# Altium schematic sheet PowerSupply.SchDoc
size A4
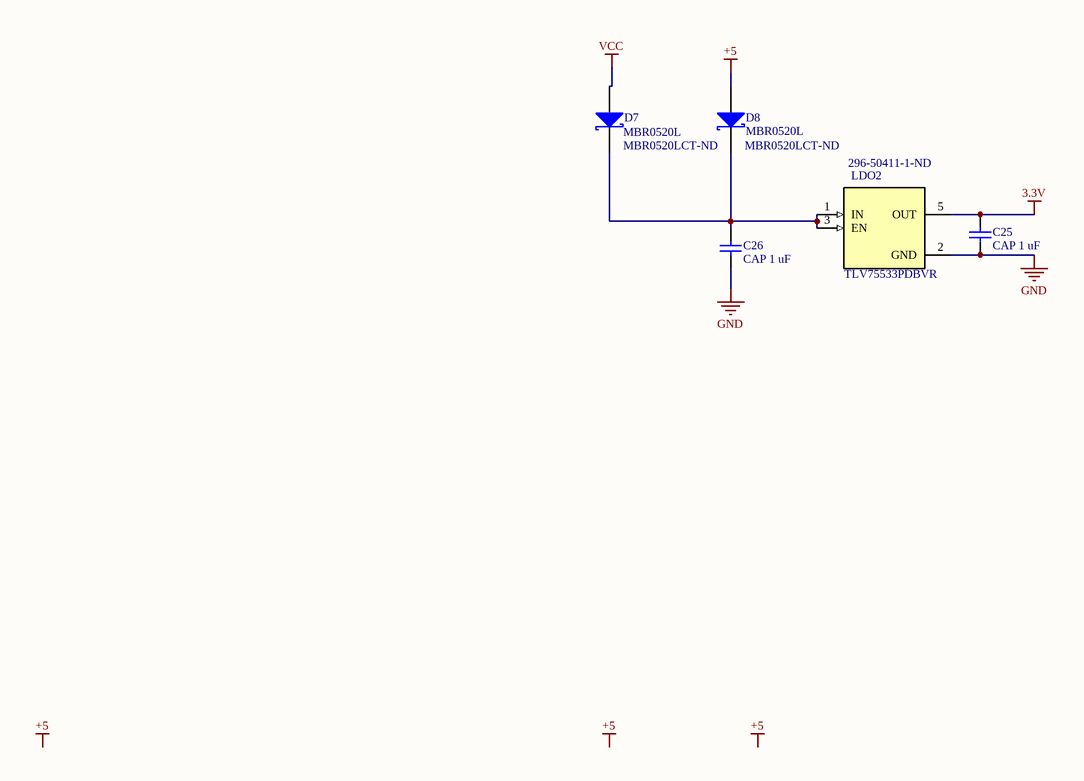
[diagram p0: PowerSupply.SchDoc]

## Parts
C25  CAP 1 uF  [CL10A105KB8NNNC]
C26  CAP 1 uF  [CL10A105KB8NNNC]
D7  MBR0520L  Supplier Part Number 1: MBR0520LCT-ND  [ON_Semi_CASE_425_0]
D8  MBR0520L  Supplier Part Number 1: MBR0520LCT-ND  [ON_Semi_CASE_425_0]
LDO2  TLV75533PDBVR  Supplier Part Number 1: 296-50411-1-ND  [SOT95P280X145-5N]

## Nets
3.3V: C25.1 LDO2.5(OUT)
+5: D8.1(A)
GND: C25.2 C26.2 LDO2.2(GND)
VCC: D7.1(A)
NetC26_1: C26.1 D7.2(K) D8.2(K) LDO2.1(IN) LDO2.3(EN)

## Notes on the sheet
- Labels drawn without touching a wire or pin: +5

## Library data of the parts
C25 C26 = Cap: Capacitor; Published: 8-Jun-2000; LatestRevisionDate: 17-Jul-2002; LatestRevisionNote: Re-released for DXP Platform.; Publisher: Altium Limited
D7 D8 = MBR0520L: Schottky Diode; Manufacturer: ON Semiconductor / Fairchild; Average Rectified Current: 500mA; Max Reverse Voltage (DC): 20V; Element Configuration: Single; Forward Voltage: 385mV; Max Surge Current: 5.5A; Peak Reverse Current: 250uA; Polarity: Standard; Power Dissipation: 400mW; Capacitance: 4pF; Current Rating: 500A; Manufacturer Part Number: MBR0520L; RoHS: Yes; Mount: Surface Mount; Number of Pins: 2; Weight: 0.03g; Min Operating Temperature: -65°C; Max Operating Temperature: 125°C; Packaging: Tape and Reel; Package Quantity: 3000; Max Forward Surge Current (Ifsm): 5.5A; Forward Current: 500mA; Max Repetitive Reverse Voltage (Vrrm): 20V; Peak Non-Repetitive Surge Current: 5.5A; Max Reverse Leakage Current: 250uA; Voltage Rating (DC): 20V; Output Current: 500mA; Length: 2.7mm; Height: 1.03mm; Width: 1.6mm; Radiation Hardening: No; Lead Free: Lead Free; REACH SVHC: No SVHC; ComponentLink1URL: http://www.farnell.com/datasheets/2304093.pdf?src-supplier=Farnell; ComponentLink1Description: http://www.farnell.com/datasheets/2304093.pdf?src-supplier=Farnell; ComponentLink2URL: http://www.mouser.com/ds/2/149/MBR0520L-67539.pdf?src-supplier=Mouser; ComponentLink2Description: http://www.mouser.com/ds/2/149/MBR0520L-67539.pdf?src-supplier=Mouser; ComponentLink3URL: https://www.fairchildsemi.com/datasheets/MB/MBR0520L.pdf?src-supplier=Digi-Key; ComponentLink3Description: https://www.fairchildsemi.com/datasheets/MB/MBR0520L.pdf?src-supplier=Digi-Key; ComponentLink4URL: https://www.fairchildsemi.com/datasheets/MB/MBR0520L.pdf?src-supplier=Avnet; ComponentLink4Description: https://www.fairchildsemi.com/datasheets/MB/MBR0520L.pdf?src-supplier=Avnet; ComponentLink5URL: http://www.fairchildsemi.com/ds/MB/MBR0520L.pdf?src-supplier=Avnet+Europe; ComponentLink5Description: http://www.fairchildsemi.com/ds/MB/MBR0520L.pdf?src-supplier=Avnet+Europe; ComponentLink6URL: http://www.jameco.com/Jameco/Products/ProdDS/871594.pdf?src-supplier=Jameco; ComponentLink6Description: http://www.jameco.com/Jameco/Products/ProdDS/871594.pdf?src-supplier=Jameco; ComponentLink7URL: http://www.fairchildsemi.com/ds/MB/MBR0520L.pdf?src-supplier=Future+Electronics; ComponentLink7Description: http://www.fairchildsemi.com/ds/MB/MBR0520L.pdf?src-supplier=Future+Electronics; ComponentLink8URL: http://www.farnell.com/datasheets/48015.pdf?src-supplier=Element14; ComponentLink8Description: http://www.farnell.com/datasheets/48015.pdf?src-supplier=Element14; Supplier 1: Digi-Key
LDO2 = TLV75533PDBVR: 500mA Low-IQ Small-Size Low-Dropout _LDO_ Regulator 5-SOT-23 -40 to 125; MF: Texas Instruments; Package: SOT-23 Texas Instruments; MP: TLV75533PDBVR; SnapEDA_Link: https://www.snapeda.com/parts/TLV75533PDBVR/Texas%20Instruments/view-part/?ref=snap; Availability: Unavailable; Price: None; Value: *; Supplier 1: Digi-Key